# EAGLE design door_lock (EAGLE 9.6.0)
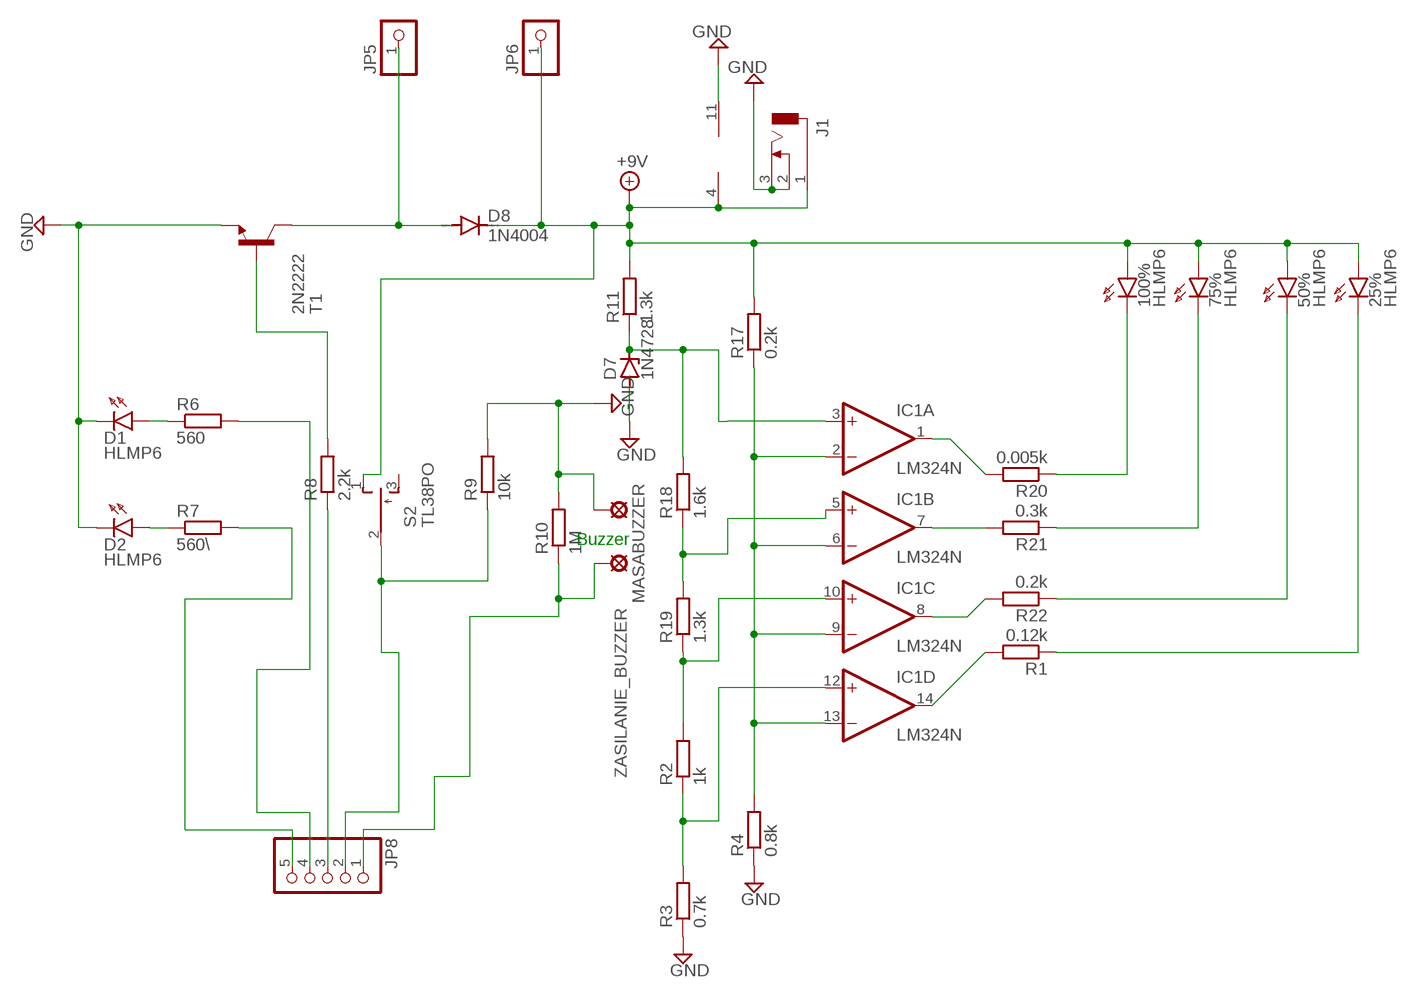
[diagram p0: schematic, sheet 1]

## Parts
25%  HLMP6  [HLMP6]
50%  HLMP6  [HLMP6]
75%  HLMP6  [HLMP6]
100%  HLMP6  [HLMP6]
D1  HLMP6  [HLMP6]
D2  HLMP6  [HLMP6]
D7  1N4728  [DO41Z10]
D8  1N4004  [DO41-10]
IC1  LM324N  [DIL14]
J1  DCJ0303  [DCJ0303]
JP5  PINHD-1X1  [1X01]
JP6  PINHD-1X1  [1X01]
JP8  PINHD-1X5  [1X05]
MASABUZZER  LSP10  [LSP10]
R1  0.12k  R-EU_0207/10  [0207/10]
R2  1k  R-EU_0207/10  [0207/10]
R3  0.7k  R-EU_0207/10  [0207/10]
R4  0.8k  R-EU_0207/10  [0207/10]
R6  560  R-EU_0207/10  [0207/10]
R7  560\  R-EU_0207/10  [0207/10]
R8  2.2k  R-EU_0207/10  [0207/10]
R9  10k  R-EU_0207/10  [0207/10]
R10  1M  R-EU_0207/10  [0207/10]
R11  1.3k  R-EU_0207/10  [0207/10]
R17  0.2k  R-EU_0207/10  [0207/10]
R18  1.6k  R-EU_0207/10  [0207/10]
R19  1.3k  R-EU_0207/10  [0207/10]
R20  0.005k  R-EU_0207/10  [0207/10]
R21  0.3k  R-EU_0207/10  [0207/10]
R22  0.2k  R-EU_0207/10  [0207/10]
S2  TL38PO  [TL3XPO]
T1  2N2222  [TO18]
ZASILANIE_BUZZER  LSP10  [LSP10]

## Nets
+9V: 25%.A 50%.A 75%.A 100%.A D8.C IC1.4(P:V+) J1.1 JP6.1 R11.2 R17.2 S2.1(O)
GND: D1.K D2.K D7.A IC1.11(P:V-) J1.2 J1.3 MASABUZZER.MP R3.1 R4.1 R9.2 R10.2 T1.1(E)
N$1: R8.2 T1.2(B)
N$2: D1.A R6.1
N$3: D2.A R7.1
N$4: IC1.1(A:OUT) R20.2
N$5: JP8.4 R6.2
N$6: JP8.3 R8.1
N$7: D8.A JP5.1 T1.3(C)
N$8: IC1.7(B:OUT) R21.2
N$9: D7.C IC1.3(A:+IN) R11.1 R18.2
N$10: IC1.5(B:+IN) R18.1 R19.2
N$11: IC1.10(C:+IN) R2.2 R19.1
N$12: IC1.12(D:+IN) R2.1 R3.2
N$13: JP8.1 R10.1 ZASILANIE_BUZZER.MP
N$14: IC1.2(A:-IN) IC1.6(B:-IN) IC1.9(C:-IN) IC1.13(D:-IN) R4.2 R17.1
N$15: JP8.2 R9.1 S2.2(P)
N$16: 75%.K R21.1
N$17: 50%.K R22.1
N$18: IC1.8(C:OUT) R22.2
N$19: IC1.14(D:OUT) R1.2
N$20: 100%.K R20.1
N$22: JP8.5 R7.2
N$23: 25%.K R1.1
Unconnected: S2.3(S)

## Notes on the sheet
- Buzzer

## Library data of the parts
25% 50% 75% 100% D1 D2 = display-hp:HLMP6: LED 2mm horizontal; MF: AGILENT TECHNOLOGIES; MPN: HLMP-6500; OC_FARNELL: 1652490; OC_NEWARK: 40K0088
D7 = diode:1N4728: Z DIODE 3.3 V, 1W, 5 percent
D8 = diode:1N4004: DIODE general purpose rectifier, 1 A
IC1 = linear:LM324: OP AMP
J1 = con-jack:DCJ0303: DC POWER JACK Source: DCJ0303.pdf; OC_FARNELL: unknown; OC_NEWARK: unknown
JP5 JP6 = pinhead:PINHD-1X1: PIN HEADER
JP8 = pinhead@1:PINHD-1X5: PIN HEADER
MASABUZZER ZASILANIE_BUZZER = solpad:LSP10: SOLDER PAD drill 1.0 mm, distributor Buerklin, 12H555
R1-R4 R6-R11 R17-R22 = rcl:R-EU_: RESISTOR, European symbol; SPICEPREFIX: R
S2 = switch:TL38PO: TINY SWITCH ON OFF MOM Source: http://www2.produktinfo.conrad.com/datenblaetter/700000-724999/705152-da-01-de-Subminiaturschalter_TL_36YO.pdf
T1 = transistor:2N2222: NPN TRANSISTOR

## Board
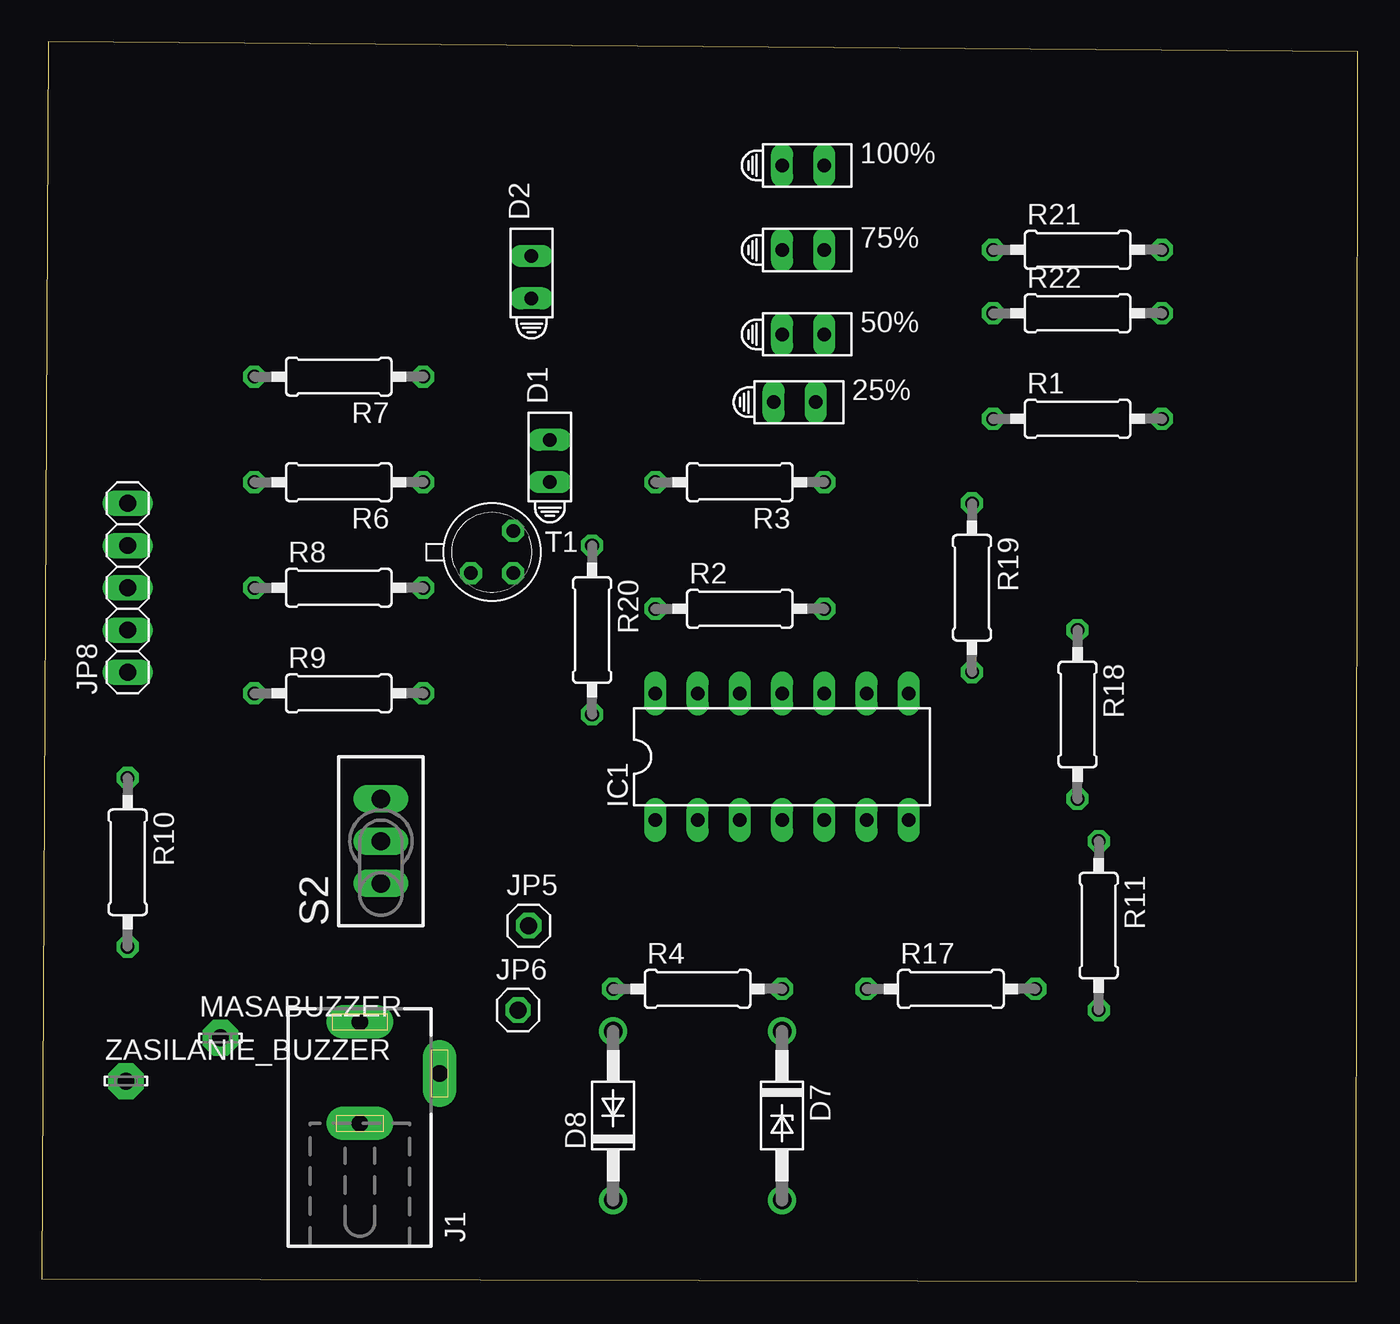
[diagram p1: board, top side]
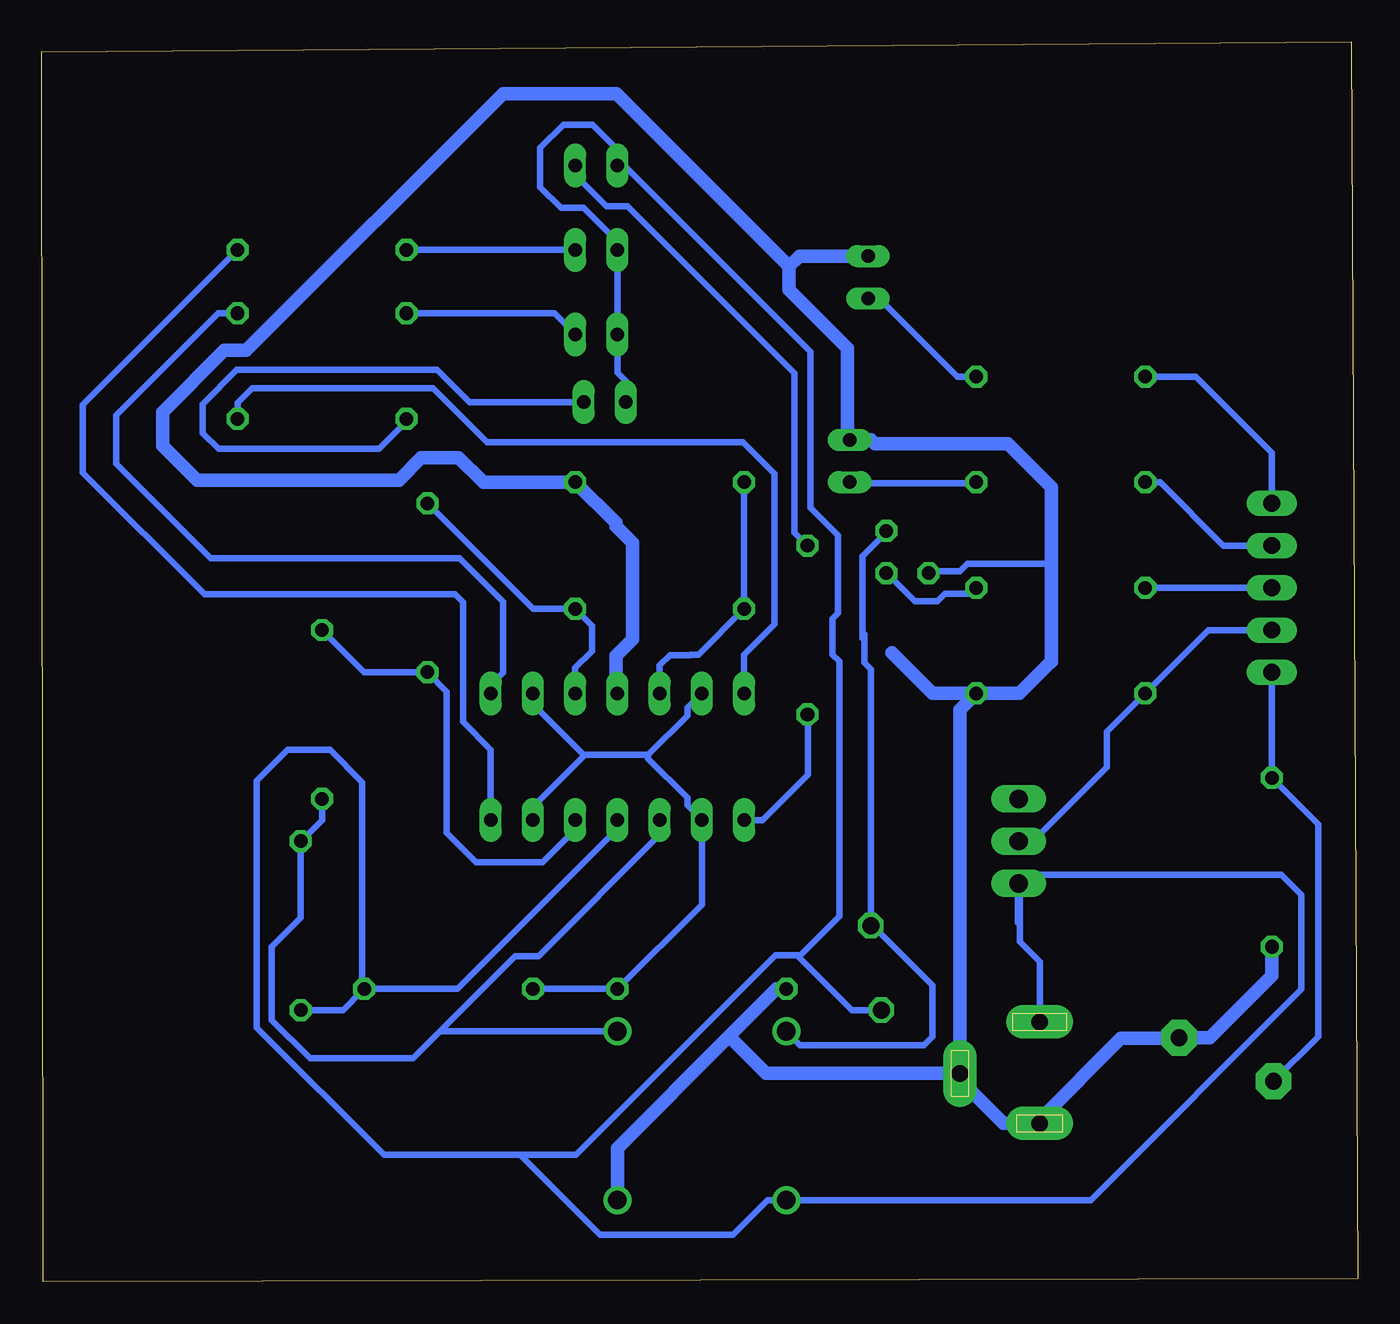
[diagram p2: board, bottom side, seen from below]

Size 79.2 x 74.6 mm. Coordinates in mm from the lower left corner, seen from the top.
Outline: 0,0.2 79.1,0 79.2,74 0.4,74.6 0,0.2
Copper layers (1*16): Top 0.035mm / dielectric 1.5mm / Bottom 0.035mm
Design rules "OpenLab": minimum track width 0.4mm, minimum drill 0.6mm, track to track 0.5mm, track to pad 0.5mm, pad to pad 0.5mm, via to via 0.5mm, smd to smd 0.1mm, copper to edge 2mm, drill to drill 0.2mm, minimum pad ring 10mil, minimum via ring 8mil, stop-mask expansion 4mil, vias tented up to drill 0mil, thermal gap 10mil

### Footprints (pad centres in the part's own frame; a part is rotated, then mirrored left to right if it is on the bottom)
HLMP6 = drill 0.813 long: A -1.27,0; K 1.27,0
DO41Z10 = drill 1.118: A 5.08,0; C -5.08,0
DO41-10 = drill 1.118: A 5.08,0; C -5.08,0
DIL14 = drill 0.813 long: 1 -7.62,-3.81; 2 -5.08,-3.81; 3 -2.54,-3.81; 4 0,-3.81; 5 2.54,-3.81; 6 5.08,-3.81; 7 7.62,-3.81; 8 7.62,3.81; 9 5.08,3.81; 10 2.54,3.81; 11 0,3.81; 12 -2.54,3.81; 13 -5.08,3.81; 14 -7.62,3.81
DCJ0303 = drill 1 pad 2 long: 1 0,3.1; 2 4.8,0; 3 0,-3
1X01 = drill 1.016 octagon: 1 0,0
1X05 = drill 1.016 long: 1 -5.08,0; 2 -2.54,0; 3 0,0; 4 2.54,0; 5 5.08,0
LSP10 = drill 1.016 pad 2.159 octagon: MP 0,0
0207/10 = drill 0.813 octagon: 1 -5.08,0; 2 5.08,0
TL3XPO = drill 1.1 pad 1.422 long: 1 -2.54,0; 2 0,0; 3 2.54,0
TO18 = drill 0.813 octagon: 1 -1.27,-1.27; 2 1.27,-1.27; 3 1.27,1.27

### Placement (x,y rotation side)
25%  45.32,52.91 0 top
50%  45.82,56.99 0 top
75%  45.82,62.07 0 top
100%  45.82,67.15 0 top
D1  30.58,49.37 90 top
D2  29.48,60.43 90 top
D7  44.55,10 270 top
D8  34.39,10 90 top
IC1  44.55,31.59 0 top
J1  19.15,12.54 0 top
JP5  29.31,21.43 0 top
JP6  28.67,16.35 0 top
JP8  5.18,41.75 90 top
MASABUZZER  10.76,14.68 0 top
R1  62.33,51.91 0 top
R2  42.01,40.48 0 top
R3  42.01,48.1 180 top
R4  39.47,17.62 0 top
R6  17.88,48.1 180 top
R7  17.88,54.45 180 top
R8  17.88,41.75 0 top
R9  17.88,35.4 0 top
R10  5.18,25.24 270 top
R11  63.6,21.43 270 top
R17  54.71,17.62 0 top
R18  62.33,34.13 270 top
R19  55.98,41.75 270 top
R20  33.12,39.21 270 top
R21  62.33,62.07 0 top
R22  62.33,58.26 0 top
S2  20.42,26.51 90 top
T1  27.1,43.9 0 top
ZASILANIE_BUZZER  5.08,12.08 0 top

### Tracks (layer width: path | path; a pad name or v marks a point on that pad's centre or on a via)
+9V
  Bottom 0.4: 20.35,21.6 20.35,20.45 19.15,19.25 J1.1 | 20.35,21.6 20.35,24.5 4.6,24.5 3.4,23.3 3.4,17.6 16.08,4.92 D8.C 35.53,4.92 37.6,2.85 45.6,2.85 50.4,7.65 | S2.1 20.45,23.94 20.45,21.6 20.35,21.6 | 33.55,19.65 35.05,19.65 47.05,7.65 50.4,7.65 | 33.55,19.65 31.2,22 31.2,37.32 31.61,37.72 31.61,39.9 31.3,40.2 31.3,44.9 32.95,46.55 32.95,55.95 44.15,67.15 100%.A 44.55,68.1 46.05,69.6 47.8,69.6 49.2,68.2 49.2,65.85 47.95,64.6 46.6,64.6 44.55,62.55 75%.A 50%.A 44.55,54.68 44.05,54.18 25%.A | 33.55,19.65 33.65,19.55 30.45,16.35 JP6.1 | 50.4,7.65 58.6,7.65 66.25,15.3 66.25,30.15 64.4,32 61.85,32 59.91,30.06 59.91,17.5 | 59.91,17.5 61.06,16.35 R11.2 | 59.91,17.5 R17.2 54.18,17.62 44.55,27.25 IC1.4
GND
  Bottom 0.4: 44.65,35.4 IC1.11 | 10.79,14.65 MASABUZZER.MP | 19.15,9.75 J1.3 | 52.67,48.15 52.62,48.1 | 44.65,45.45 44.65,45.66 | 25.6,35.4 25.75,35.55 | 18.46,37.3 18.45,37.3 | 69.83,48.23 69.77,48.23 | 35.67,12.6 35.61,12.54 | 23.95,12.15 J1.2 | 18.45,43.2 23.5,43.2 23.95,42.75 25.75,42.75 T1.1
  Bottom 0.8: 37.84,14.77 44.55,8.05 D7.A | 37.84,14.77 34.98,17.62 R4.1 | 44.65,45.45 43.65,44.45 43.65,38.65 44.65,37.65 44.65,35.4 | MASABUZZER.MP 8.92,14.68 5.18,18.42 R10.2 | 18.45,37.3 18.45,43.2 18.45,47.8 21.05,50.4 29.07,50.4 29.31,50.64 D1.K 30.7,50.76 30.7,56.15 34.22,59.67 34.22,61.08 | 10.79,14.65 14.25,14.65 19.15,9.75 | 52.67,48.15 54.1,49.58 56.35,49.58 57.7,48.23 69.77,48.23 | 37.84,14.77 35.67,12.6 | J1.3 21.34,9.54 23.95,12.15 | 34.22,61.08 44.61,71.47 51.43,71.47 66.88,56.02 68.2,56.02 71.9,52.32 71.9,50.3 69.83,48.23 | 52.62,48.1 R3.1 44.65,45.66 | R9.2 23.95,34.41 J1.2 35.61,12.54 | R9.2 25.6,35.4 | R9.2 20.36,35.4 18.46,37.3 | 25.75,35.55 28.04,37.84 | D2.K 33.6,61.7 34.22,61.08
N$1
  Bottom 0.4: R8.2 23.05,41.4 24.85,41.4 25.3,40.95 26.65,40.95 28,42.3 T1.2
N$2
  Bottom 0.4: D1.A 30.53,48.05 23.01,48.05 R6.1
N$3
  Bottom 0.4: R7.1 24.11,54.45 28.82,59.16 D2.A
N$4
  Bottom 0.4: IC1.1 35.82,27.78 33.1,30.5 33.1,34.11 R20.2
N$5
  Bottom 0.4: R6.2 11.9,48.1 8.09,44.29 JP8.4
N$6
  Bottom 0.4: JP8.3 R8.1
N$7
  Bottom 0.4: 29.7,38.7 29.7,37.25 29.31,36.86 JP5.1 29.18,21.43 25.6,17.85 25.6,14.75 26.1,14.25 33.56,14.25 D8.A | 29.7,38.7 29.7,38.96 | T1.3 28.45,45 29.8,43.65 29.8,38.7 29.7,38.7
N$8
  Bottom 0.4: R21.2 76.73,52.75 76.73,48.68 69.4,41.35 69.39,41.36 54.33,41.36 53.85,40.88 53.85,33.7 52.17,32.02 IC1.7
N$9
  Bottom 0.4: 55.22,15.08 50.7,19.6 49.3,19.6 42.01,26.89 IC1.3 | D7.C 55.22,15.08 | 55.22,15.08 56.85,13.45 63.05,13.45 65.35,15.75 65.35,20.15 63.6,21.9 R11.1 62.33,27.77 R18.2
N$10
  Bottom 0.4: IC1.5 47.09,27.21 49.05,25.25 53.05,25.25 54.82,27.02 54.82,35.5 55.98,36.66 R19.2 59.79,36.67 R18.1
N$11
  Bottom 0.4: IC1.10 47.09,36.94 46.09,37.94 46.09,39.48 R2.2 49.63,40.48 R19.1
N$12
  Bottom 0.4: R3.2 R2.1 39.69,37.72 40.16,37.72 40.18,37.7 41.4,37.7 42.01,37.09 IC1.12
N$13
  Bottom 0.4: ZASILANIE_BUZZER.MP 2.4,14.76 2.4,27.54 R10.1 JP8.1
N$14
  Bottom 0.4: IC1.6 49.6,27.81 49.6,28.6 46.5,31.7 | R17.1 R4.2 39.47,22.7 IC1.2 40.35,28.66 40.35,29.13 42.7,31.48 42.7,31.7 | IC1.13 40.35,34.52 40.35,34.05 42.7,31.7 | 42.7,31.7 46.5,31.7 | 46.5,31.7 46.6,31.7 49.63,34.73 IC1.9
N$15
  Bottom 0.4: S2.2 19.55,26.51 15.1,30.96 15.1,33.1 R9.1 8.99,39.21 JP8.2
N$16
  Bottom 0.4: R21.1 75%.K
N$17
  Bottom 0.4: 50%.K 48.35,58.25 R22.1
N$18
  Bottom 0.4: IC1.8 52.17,35.9 51.43,36.64 51.43,40.9 54.05,43.52 69.02,43.52 74.7,49.2 74.7,52.14 68.58,58.26 R22.2
N$19
  Bottom 0.4: IC1.14 36.93,37.72 35.1,39.55 35.1,48.62 36.24,49.76 36.26,49.76 37,50.5 52.4,50.5 55.65,53.75 66.53,53.75 67.41,52.87 R1.2
N$20
  Bottom 0.4: R20.1 33.9,45.07 33.9,54.65 43.95,64.7 45.2,64.7 47.09,66.59 100%.K
N$22
  Bottom 0.4: R7.2 9.76,54.45 5.18,49.87 JP8.5
N$23
  Bottom 0.4: R1.1 57.25,51.75 58.9,50.1 68.55,50.1 69.5,51.05 69.5,52.8 67.45,54.85 55.4,54.85 53.45,52.9 25%.K